# Altium project Using Design Variants - Brendan Cook.PrjPcb
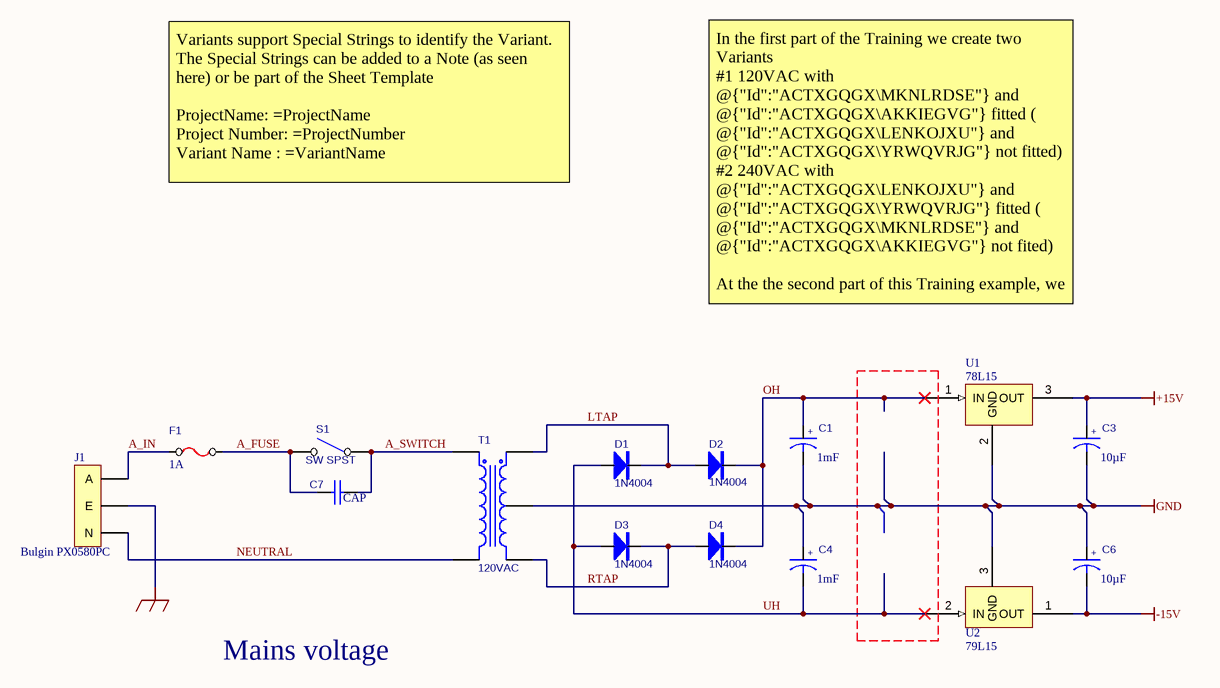
[diagram p0: True Variant.SchDoc]
ProjectNumber: ABC123-Default
1 sheet, 15 parts. Net scope: global (net labels, ports and power ports of the same name join across sheets).
Board file: True Variant.PcbDoc

## Sheet True Variant.SchDoc: Using Design Variants
size 431 x 279 mm; SheetNumber: 1; SheetTotal: 1

### Parts
C1  value 1mF  [RB.4_.8]  (hidden comment: CAP1000uF)
C3  value 10µF  [RB.2_.4]  (hidden comment: CAP Polar 10uF)
C4  value 1mF  [RB.4_.8]  (hidden comment: CAP1000uF)
C6  value 10µF  [RB.2_.4]  (hidden comment: CAP Polar 10uF)
C7  CAP  [RAD0.8]
D1  1N4004  [DIODE0.5]
D2  1N4004  [DIODE0.5]
D3  1N4004  [DIODE0.5]
D4  1N4004  [DIODE0.5]
F1  Current Rating: 1A  [FUSE]  (hidden comment: FUSE)
J1  Bulgin PX0580PC  [Bulgin PX0580PC]
S1  SW SPST  [SW-MAINS]
T1  120VAC  [TRANSFORMER]
U1  78L15  [TO-92A]
U2  79L15  [TO-92A]

### Nets
+15V: C3.1 U1.3(OUT)
-15V: C6.2 U2.1(OUT)
CHASSIS: J1.2(E)
GND: C1.2 C3.2 C4.1 C6.1 T1.4(SecCT) U1.2(GND) U2.3(GND)
A_FUSE: C7.2 F1.2 S1.2(NO)
A_IN: F1.1 J1.1(A)
A_SWITCH: C7.1 S1.1(COMMON) T1.1(Pri+)
LTAP: D1.2(K) D2.1(A) T1.3(Sec+)
NEUTRAL: J1.3(N) T1.2(Pri-)
OH: C1.1 D2.2(K) D4.2(K) U1.1(IN)
RTAP: D3.2(K) D4.1(A) T1.5(Sec-)
UH: C4.2 D1.1(A) D3.1(A) U2.2(IN)

### Notes on the sheet
- Variants support Special Strings to identify the Variant.
  The Special Strings can be added to a Note (as seen here) or be part of the Sheet Template
  ProjectName: =ProjectName
  Project Number: =ProjectNumber
  Variant Name : =VariantName
- In the first part of the Training we create two Variants
  #1 120VAC with @{"Id":"ACTXGQGX\MKNLRDSE"} and @{"Id":"ACTXGQGX\AKKIEGVG"} fitted ( @{"Id":"ACTXGQGX\LENKOJXU"} and @{"Id":"ACTXGQGX\YRWQVRJG"} not fitted)
  #2 240VAC with @{"Id":"ACTXGQGX\LENKOJXU"} and @{"Id":"ACTXGQGX\YRWQVRJG"} fitted ( @{"Id":"ACTXGQGX\MKNLRDSE"} and @{"Id":"ACTXGQGX\AKKIEGVG"} not fited)
  At the the second part of this Training example, we no longer use multiple components to be fitted and unfitted when using variants. @{"Id":"ACTXGQGX\MKNLRDSE"} and @{"Id":"ACTXGQGX\AKKIEGVG"} will change its value from 1000uF to 2000uF whenever the user change the display variant from 120 VAC to 240 VAC at the compile tab.
- Mains voltage
- DWG. NO.
- REV.
- SHT.
- THIS DOCUMENT AND THE DATA DISCLOSED HEREIN OR HEREWITH IS THE PROPERTY OF ALTIUM LIMITED AND MAY BE FREELY DISTRIBUTED IN WHOLE. NO RIGHTS ARE RESERVED OR EXPRESS OR IMPLIED WARANTEE GIVEN.
- REVISION
- DESCRIPTION
- DATE
- APPROVED
- ENG:
- APPROVALS
- PROJECT
- DSN:
- CHK:
- REFERENCE DOCUMENTS
- PROJECT REVISION:
- TITLE
- DOCUMENT REVISION:
- DESIGN ITEM:
- BOM:
- FAB DWG:
- PCB DWG:
- ASSY DWG:
- SCALE:
- SIZE
- B
- CAGE CODE
- FILE NAME
- DWG NO.
- SHEET
- OF
- REV
- (in symbol CMP-001-00084-6) +
- (in symbol CMP-001-00087-4) +

### Library data of the parts
C1 C4 = CMP-001-00084-6: Bi-Polar Capacitor; Design Item ID: CAP1000uF; Source: True Variant.SCHLIB; Capacitor Type: Bi-Polar; Case/Package: RB.4/.8; Mounting Technology: THT; Pins: 2
C3 C6 = CMP-001-00087-4: CAP-Polar 10uF; Capacitor Type: Bi-Polar; Case/Package: RB.2/.4; Mounting Technology: THT; Pins: 2
C7 = CMP-001-00083-3: 1nF / 2kV; Design Item ID: CAP; Source: True Variant.SCHLIB
D1-D4 = CMP-004-00031-4: Design Item ID: 1N4004; Source: True Variant.SCHLIB; Case/Package: Diode0.5; Pins: 2; RoHS Compliant: No
F1 = CMP-005-00013-4: Design Item ID: FUSE; Source: True Variant.SCHLIB; Case/Package: Fuse
J1 = CMP-002-00078-1: Connector Type: Power; Gender: Male; Max Current Rating: 10A; Voltage Rating: 250V; Mounting Technology: Panel,Board; Pins: 3; RoHS Compliant: Yes
S1 = CMP-009-000000-5: Main Switch; Current Rating: 1A; Max Current Rating: 10A; Design Item ID: SW SPST; Source: True Variant.SCHLIB
T1 = CMP-012-00000-4: Center-Tapped Transformer; Voltage Rating: 120V; Design Item ID: 120VAC; Source: True Variant.SCHLIB; Mounting Technology: THT; Pins: 5
U1 = CMP-011-000000-4: Very Low Drop Voltage Regulators With Inhibit; Output Voltage: 15V; Design Item ID: 78L15; Source: True Variant.SCHLIB; Case/Package: TO-92A; Mounting Technology: THT; Pins: 3
U2 = CMP-011-000001-4: Very Low Drop Voltage Regulators With Inhibit; Output Voltage: -15V; Design Item ID: 79L15; Source: True Variant.SCHLIB; Case/Package: TO-92A; Mounting Technology: THT; Pins: 3

## Assembly variants
120VAC: all parts fitted
240VAC: alternate parts C1 -> CMP-001-00085-7, C4 -> CMP-001-00085-7